# EAGLE design 6502 Based Board (EAGLE 6.6.0)
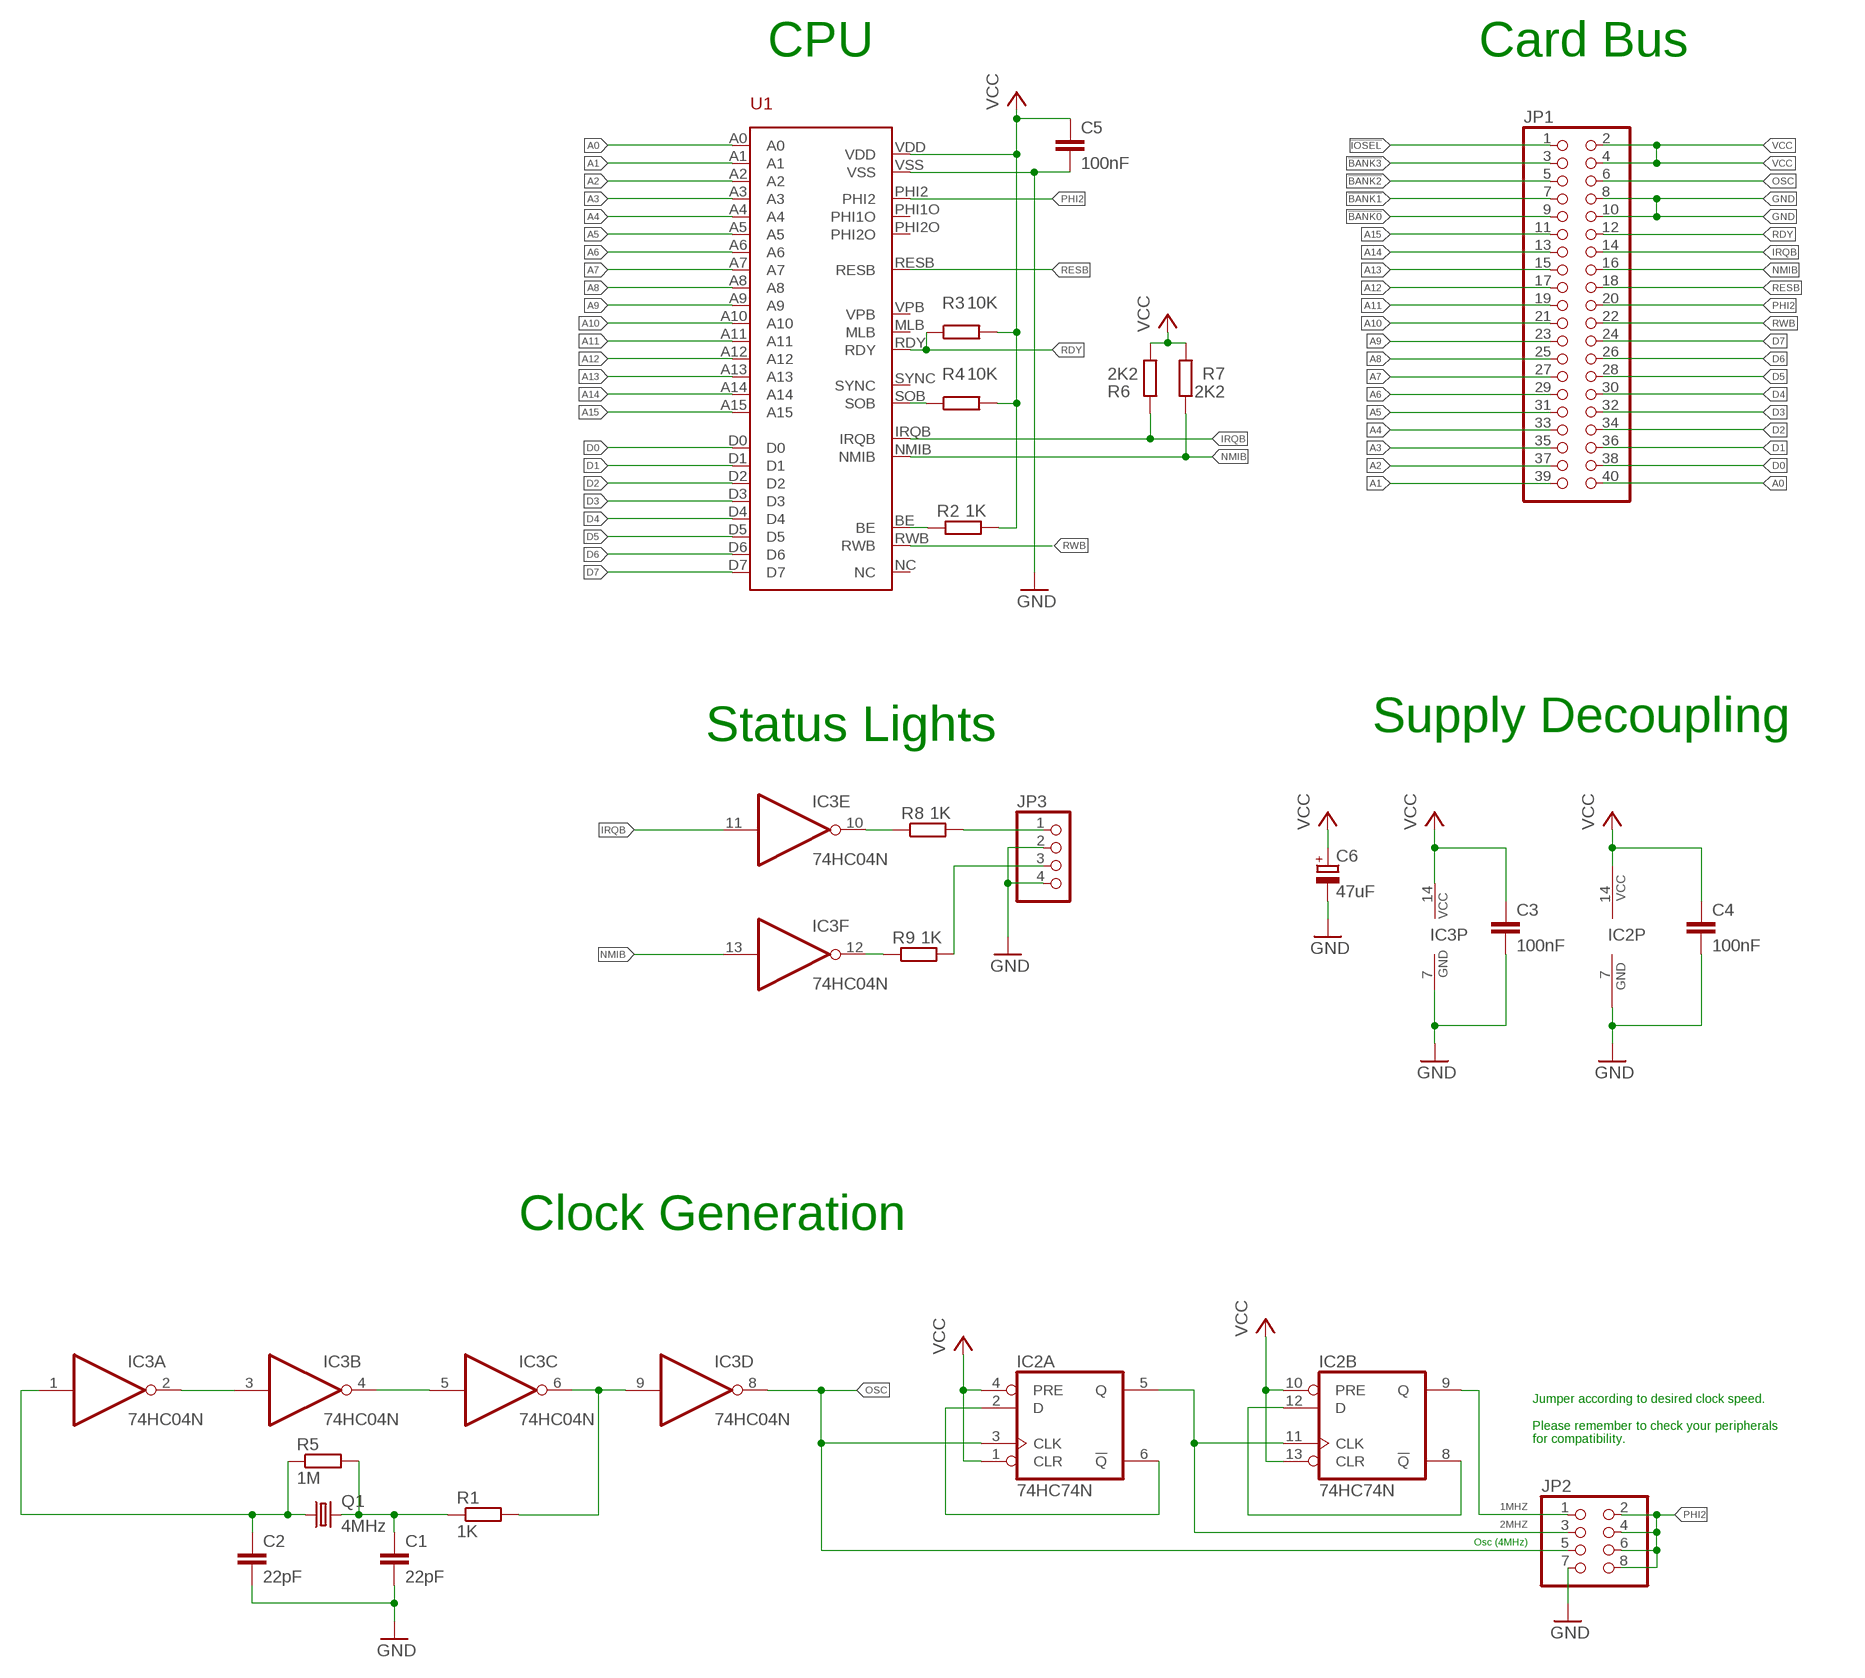
[diagram p0: schematic, sheet 1]

## Parts
C1  22pF  C-EU050-025X075  [C050-025X075]
C2  22pF  C-EU050-025X075  [C050-025X075]
C3  100nF  C-EU050-025X075  [C050-025X075]
C4  100nF  C-EU050-025X075  [C050-025X075]
C5  100nF  C-EU050-025X075  [C050-025X075]
C6  47uF  CPOL-EUE2.5-7  [E2,5-7]
IC2  74HC74N  74LS74N  [DIL14]
IC3  74HC04N  [DIL14]
JP1  PINHD-2X20/90  [2X20/90]
JP2  PINHD-2X4  [2X04]
JP3  PINHD-1X4/90  [1X04/90]
Q1  4MHz  CRYSTALHC49S  [HC49/S]
R1  1K  R-EU_0207/2V  [0207/2V]
R2  1K  R-EU_0207/2V  [0207/2V]
R3  10K  R-EU_0207/2V  [0207/2V]
R4  10K  R-EU_0207/2V  [0207/2V]
R5  1M  R-EU_0207/2V  [0207/2V]
R6  2K2  R-EU_0207/10  [0207/10]
R7  2K2  R-EU_0207/10  [0207/10]
R8  1K  R-EU_0207/2V  [0207/2V]
R9  1K  R-EU_0207/2V  [0207/2V]
U1  W65C02S-DIP  [DIP40]

## Nets
1MHZ: IC2.9(B:Q) JP2.1
2MHZ: IC2.5(A:Q) IC2.11(B:CLK) JP2.3
!BANK0: JP1.9
!BANK1: JP1.7
!BANK2: JP1.5
!BANK3: JP1.3
!IOSEL: JP1.1
A0: JP1.40 U1.A0
A1: JP1.39 U1.A1
A2: JP1.37 U1.A2
A3: JP1.35 U1.A3
A4: JP1.33 U1.A4
A5: JP1.31 U1.A5
A6: JP1.29 U1.A6
A7: JP1.27 U1.A7
A8: JP1.25 U1.A8
A9: JP1.23 U1.A9
A10: JP1.21 U1.A10
A11: JP1.19 U1.A11
A12: JP1.17 U1.A12
A13: JP1.15 U1.A13
A14: JP1.13 U1.A14
A15: JP1.11 U1.A15
D0: JP1.38 U1.D0
D1: JP1.36 U1.D1
D2: JP1.34 U1.D2
D3: JP1.32 U1.D3
D4: JP1.30 U1.D4
D5: JP1.28 U1.D5
D6: JP1.26 U1.D6
D7: JP1.24 U1.D7
GND: C1.2 C2.2 C3.2 C4.2 C5.2 C6.- IC2.7(P:GND) IC3.7(P:GND) JP1.8 JP1.10 JP2.7 JP3.2 JP3.4 U1.VSS
IRQ_LED: JP3.1 R8.2
IRQB: IC3.11(E:I) JP1.14 R6.1 U1.IRQB
N$1: IC2.2(A:D) IC2.6(A:!Q)
N$2: IC3.4(B:O) IC3.5(C:I)
N$3: IC3.6(C:O) IC3.9(D:I) R1.2
N$4: C1.1 Q1.2 R1.1 R5.2
N$5: C2.1 IC3.1(A:I) Q1.1 R5.1
N$7: IC3.2(A:O) IC3.3(B:I)
N$8: IC2.8(B:!Q) IC2.12(B:D)
N$11: IC3.10(E:O) R8.1
N$12: IC3.12(F:O) R9.1
N$15: R2.1 U1.BE
N$16: R4.1 U1.SOB
NMI_LED: JP3.3 R9.2
NMIB: IC3.13(F:I) JP1.16 R7.1 U1.NMIB
OSC: IC2.3(A:CLK) IC3.8(D:O) JP1.6 JP2.5
PHI2: JP1.20 JP2.2 JP2.4 JP2.6 JP2.8 U1.PHI2
RDY: JP1.12 R3.1 U1.RDY
RESB: JP1.18 U1.RESB
RWB: JP1.22 U1.RWB
VCC: C3.1 C4.1 C5.1 C6.+ IC2.1(A:CLR) IC2.4(A:PRE) IC2.10(B:PRE) IC2.13(B:CLR) IC2.14(P:VCC) IC3.14(P:VCC) JP1.2 JP1.4 R2.2 R3.2 R4.2 R6.2 R7.2 U1.VDD
Unconnected: U1.MLB U1.NC U1.PHI1O U1.PHI2O U1.SYNC U1.VPB

## Notes on the sheet
- CPU | Card Bus
- Status Lights | Supply Decoupling
- Clock Generation
- Jumper according to desired clock speed.
  
  Please remember to check your peripherals
  for compatibility.
- Osc (4MHz)

## Library data of the parts
C1-C5 = rcl:C-EU: CAPACITOR, European symbol
C6 = rcl:CPOL-EU: POLARIZED CAPACITOR, European symbol
IC2 = 74xx-us:74*74: Dual D type positive edge triggered FLIP FLOP, preset and clear
IC3 = 74xx-eu:74*04: Hex INVERTER
JP1 = pinhead:PINHD-2X20: PIN HEADER
JP2 = pinhead:PINHD-2X4: PIN HEADER
JP3 = pinhead:PINHD-1X4: PIN HEADER
Q1 = crystal:CRYSTAL: CRYSTAL; OC_FARNELL: 1667008; OC_NEWARK: unknown
R1-R9 = rcl:R-EU_: RESISTOR, European symbol
U1 = W65C02S:W65C02S-DIP

## Board
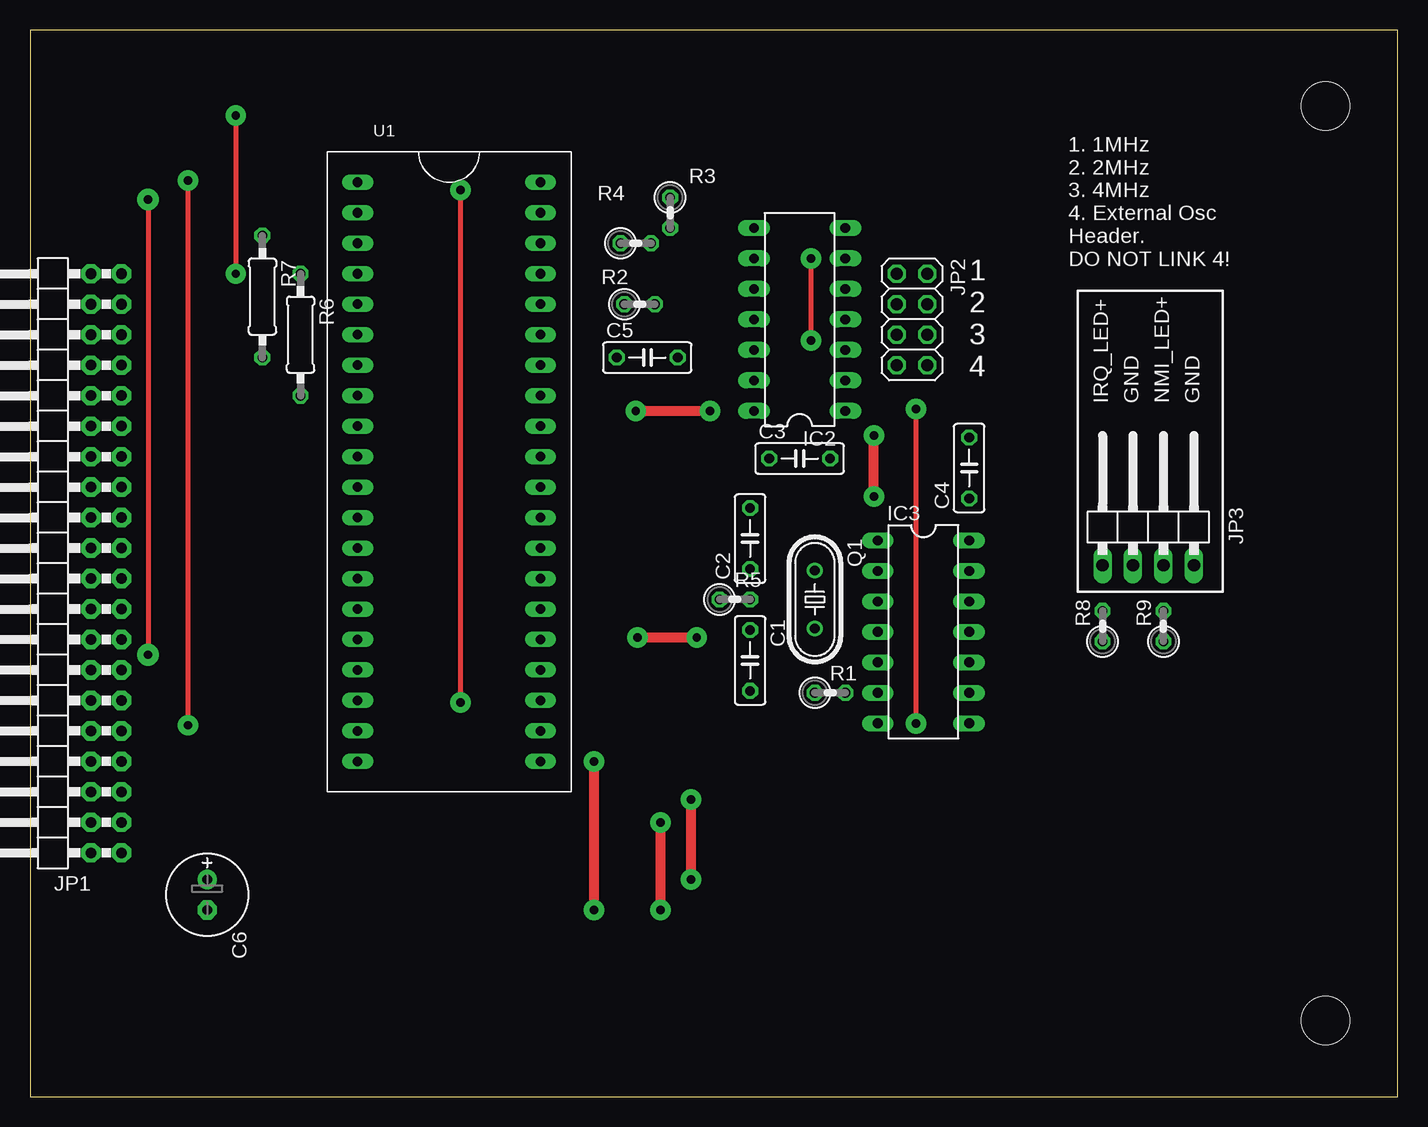
[diagram p1: board, top side]
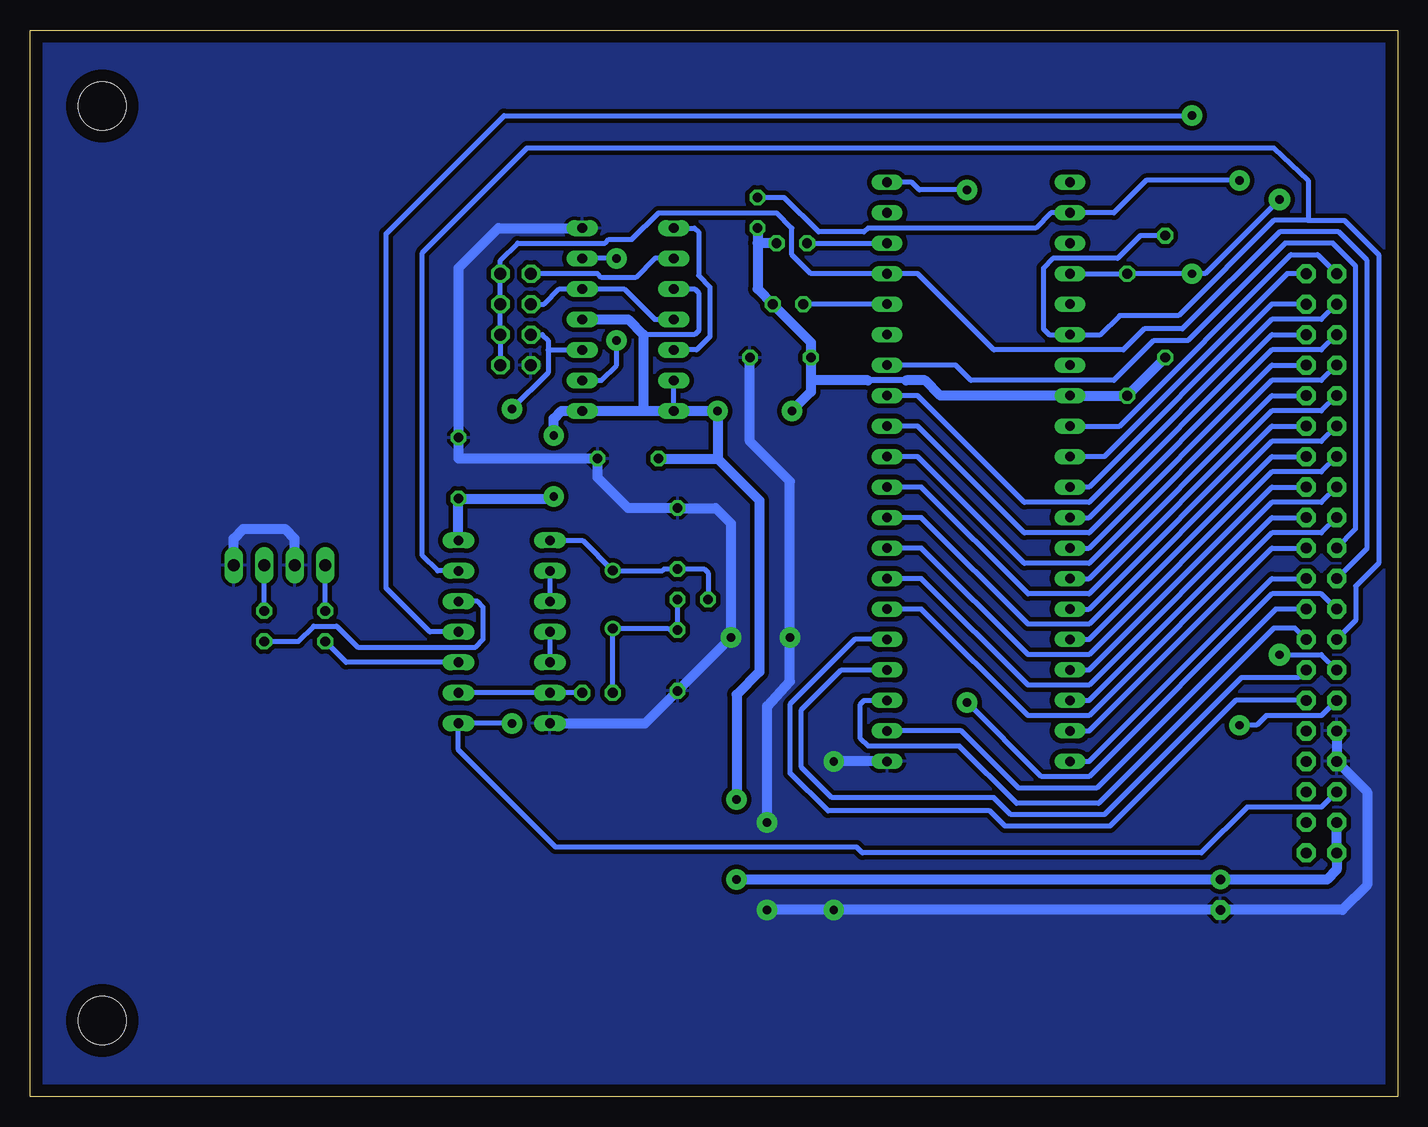
[diagram p2: board, bottom side, seen from below]

Size 113.97 x 88.89 mm. Coordinates in mm from the lower left corner, seen from the top.
Outline: 0,0 113.97,0 113.97,88.89 0,88.89 0,0
Copper layers (1*16): Top 0.035mm / dielectric 1.5mm / Bottom 0.035mm
Design rules "default *": minimum track width 10mil, minimum drill 24mil, track to track 8mil, track to pad 8mil, pad to pad 8mil, via to via 8mil, smd to smd 8mil, copper to edge 40mil, drill to drill 8mil, minimum pad ring 10mil, minimum via ring 8mil, stop-mask expansion 4mil, vias tented up to drill 0mil, thermal gap 12mil
Holes 4 mm at 107.95,82.55 107.95,6.35

### Footprints (pad centres in the part's own frame; a part is rotated, then mirrored left to right if it is on the bottom)
C050-025X075 = drill 0.813 octagon: 1 -2.54,0; 2 2.54,0
E2,5-7 = drill 0.813 pad 1.6: + -1.27,0 | drill 0.813 pad 1.6 octagon: - 1.27,0
DIL14 = drill 0.813 long: 1 -7.62,-3.81; 2 -5.08,-3.81; 3 -2.54,-3.81; 4 0,-3.81; 5 2.54,-3.81; 6 5.08,-3.81; 7 7.62,-3.81; 8 7.62,3.81; 9 5.08,3.81; 10 2.54,3.81; 11 0,3.81; 12 -2.54,3.81; 13 -5.08,3.81; 14 -7.62,3.81
2X20/90 = drill 0.889 pad 1.6 octagon: 1 -24.13,-6.35; 2 -24.13,-3.81; 3 -21.59,-6.35; 4 -21.59,-3.81; 5 -19.05,-6.35; 6 -19.05,-3.81; 7 -16.51,-6.35; 8 -16.51,-3.81; 9 -13.97,-6.35; 10 -13.97,-3.81; 11 -11.43,-6.35; 12 -11.43,-3.81; 13 -8.89,-6.35; 14 -8.89,-3.81; 15 -6.35,-6.35; 16 -6.35,-3.81; 17 -3.81,-6.35; 18 -3.81,-3.81; 19 -1.27,-6.35; 20 -1.27,-3.81; 21 1.27,-6.35; 22 1.27,-3.81; 23 3.81,-6.35; 24 3.81,-3.81; 25 6.35,-6.35; 26 6.35,-3.81; 27 8.89,-6.35; 28 8.89,-3.81; 29 11.43,-6.35; 30 11.43,-3.81; 31 13.97,-6.35; 32 13.97,-3.81; 33 16.51,-6.35; 34 16.51,-3.81; 35 19.05,-6.35; 36 19.05,-3.81; 37 21.59,-6.35; 38 21.59,-3.81; 39 24.13,-6.35; 40 24.13,-3.81
2X04 = drill 1.016 octagon: 1 -3.81,-1.27; 2 -3.81,1.27; 3 -1.27,-1.27; 4 -1.27,1.27; 5 1.27,-1.27; 6 1.27,1.27; 7 3.81,-1.27; 8 3.81,1.27
1X04/90 = drill 1.016 long: 1 -3.81,-3.81; 2 -1.27,-3.81; 3 1.27,-3.81; 4 3.81,-3.81
HC49/S = drill 0.813: 1 -2.413,0; 2 2.413,0
0207/2V = drill 0.813 octagon: 1 -1.27,0; 2 1.27,0
0207/10 = drill 0.813 octagon: 1 -5.08,0; 2 5.08,0
DIP40 = drill 0.8 long: A0 -7.62,3.81; A1 -7.62,1.27; A2 -7.62,-1.27; A3 -7.62,-3.81; A4 -7.62,-6.35; A5 -7.62,-8.89; A6 -7.62,-11.43; A7 -7.62,-13.97; A8 -7.62,-16.51; A9 -7.62,-19.05; A10 -7.62,-21.59; A11 -7.62,-24.13; A12 7.62,-21.59; A13 7.62,-19.05; A14 7.62,-16.51; A15 7.62,-13.97; BE 7.62,13.97; D0 7.62,6.35; D1 7.62,3.81; D2 7.62,1.27; D3 7.62,-1.27; D4 7.62,-3.81; D5 7.62,-6.35; D6 7.62,-8.89; D7 7.62,-11.43; IRQB -7.62,16.51; MLB -7.62,13.97; NC 7.62,11.43; NMIB -7.62,11.43; PHI1O -7.62,19.05; PHI2 7.62,16.51; PHI2O 7.62,21.59; RDY -7.62,21.59; RESB 7.62,24.13; RWB 7.62,8.89; SOB 7.62,19.05; SYNC -7.62,8.89; VDD -7.62,6.35; VPB -7.62,24.13; VSS 7.62,-24.13

### Placement (x,y rotation side)
C1  60.01,36.35 270 top
C2  60.01,46.51 90 top
C3  64.14,53.18 0 top
C4  78.26,52.39 90 top
C5  51.44,61.59 0 top
C6  14.76,16.83 270 top
IC2  64.14,64.77 90 top
IC3  74.45,38.73 270 top
JP1  1.27,44.45 90 top
JP2  73.5,64.77 270 top
JP3  93.19,48.1 0 top
Q1  65.41,41.43 270 top
R1  66.67,33.66 0 top
R2  50.8,66.04 0 top
R3  53.34,73.66 270 top
R4  50.48,71.12 0 top
R5  58.74,41.43 0 top
R6  22.54,63.5 270 top
R7  19.37,66.67 270 top
R8  89.38,39.21 90 top
R9  94.46,39.21 90 top
U1  34.92,52.07 0 top

### Tracks (layer width: path | path; a pad name or v marks a point on that pad's centre or on a via)
1MHZ
  Bottom 0.406: IC2.9 61.91,69.85 63.5,68.26 66.36,68.26 66.67,68.58 JP2.1
2MHZ
  Bottom 0.406: JP2.3 71.12,66.04 69.85,67.31 IC2.5 64.45,67.31 61.91,64.77 IC2.11
A0
  Bottom 0.406: U1.A0 23.18,55.88 8.89,70.17 6.67,70.17 JP1.40
A1
  Bottom 0.406: JP1.39 9.21,68.58 24.45,53.34 U1.A1
A2
  Bottom 0.406: JP1.37 10.48,66.04 25.72,50.8 U1.A2
A3
  Bottom 0.406: U1.A3 25.72,48.26 10.48,63.5 JP1.35
A4
  Bottom 0.406: U1.A4 25.72,45.72 10.48,60.96 JP1.33
A5
  Bottom 0.406: U1.A5 25.72,43.18 10.48,58.42 JP1.31
A6
  Bottom 0.406: U1.A6 25.72,40.64 10.48,55.88 JP1.29
A7
  Bottom 0.406: U1.A7 25.72,38.1 10.48,53.34 JP1.27
A8
  Bottom 0.406: U1.A8 25.72,35.56 10.48,50.8 JP1.25
A9
  Bottom 0.406: U1.A9 25.72,33.02 10.48,48.26 JP1.23
A10
  Bottom 0.406: U1.A10 25.72,30.48 10.48,45.72 JP1.21
A11
  Bottom 0.406: U1.A11 25.72,27.94 10.48,43.18 JP1.19
A12
  Bottom 0.406: JP1.17 10.16,40.64 25.08,25.72 31.59,25.72 36.35,30.48 U1.A12
A13
  Bottom 0.406: JP1.15 8.57,39.05 10.32,39.05 24.92,24.45 31.75,24.45 36.51,29.21 44.13,29.21 44.77,29.84 44.77,32.7 44.45,33.02 U1.A13
A14
  Bottom 0.406: JP1.13 8.26,34.92 13.02,34.92 24.45,23.5 32.23,23.5 33.66,24.92 47.15,24.92 49.69,27.46 49.69,32.23 46.35,35.56 U1.A14
A15
  Bottom 0.406: JP1.11 13.49,33.02 23.97,22.54 32.7,22.54 33.97,23.81 47.47,23.81 50.64,26.99 50.64,32.7 45.24,38.1 U1.A15
D0
  Bottom 0.406: JP1.38 6.35,64.77 10.48,64.77 25.72,49.53 31.11,49.53 40.01,58.42 U1.D0
D1
  Bottom 0.406: JP1.36 6.35,62.23 10.48,62.23 25.72,46.99 31.11,46.99 40.01,55.88 U1.D1
D2
  Bottom 0.406: JP1.34 6.35,59.69 10.48,59.69 25.72,44.45 31.11,44.45 40.01,53.34 U1.D2
D3
  Bottom 0.406: JP1.32 6.35,57.15 10.48,57.15 25.72,41.91 30.8,41.91 39.69,50.8 U1.D3
D4
  Bottom 0.406: JP1.30 6.35,54.61 10.48,54.61 25.72,39.37 30.8,39.37 39.69,48.26 U1.D4
D5
  Bottom 0.406: JP1.28 6.35,52.07 10.48,52.07 25.72,36.83 30.8,36.83 39.69,45.72 U1.D5
D6
  Bottom 0.406: JP1.26 6.35,49.53 10.48,49.53 25.72,34.29 30.8,34.29 39.69,43.18 U1.D6
D7
  Bottom 0.406: JP1.24 6.35,46.99 10.48,46.99 25.72,31.75 30.8,31.75 39.69,40.64 U1.D7
GND  (via drill 0.7 pad 1.7)
  Top 0.813: v52.55,15.56 v52.55,22.86 | v46.99,27.94 v46.99,15.56 | v55.56,38.26 v50.64,38.26
  Bottom 0.813: v52.55,22.86 52.55,32.54 50.64,34.61 v50.64,38.26 50.64,51.28 53.98,54.61 C5.2 | IC2.7 74.93,72.39 78.26,69.06 78.26,53.18 C3.2 66.67,51.59 64.14,49.05 C2.2 56.83,49.05 55.56,47.78 v55.56,38.26 C1.2 62.71,31.11 IC3.7 | U1.VSS v46.99,27.94 | JP1.10 JP1.8 2.54,25.4 2.54,17.62 4.6,15.56 C6.- v46.99,15.56 v52.55,15.56 | JP3.4 97,46.51 96.2,47.31 92.71,47.31 91.92,46.51 JP3.2
  pour Bottom (isolate 0.381): 0,88.9 0,0 114.14,0 114.14,88.9
IRQ_LED
  Bottom 0.406: R8.2 JP3.1
IRQB  (via drill 0.7 pad 1.7, 0.7 pad 1.8)
  Top 0.406: v9.84,74.77 v9.84,36.83 | v17.14,81.76 v17.14,68.58
  Bottom 0.406: U1.IRQB R6.1 v17.14,68.58 16.03,68.58 v9.84,74.77 | v9.84,36.83 6.35,36.83 JP1.14 | v17.14,81.76 74.45,81.76 84.3,71.91 84.3,42.39 80.64,38.73 IC3.11
N$1  (via drill 0.7 pad 1.7)
  Top 0.406: v65.09,63.02 v65.09,69.85
  Bottom 0.406: IC2.2 66.36,59.69 65.09,60.96 v65.09,63.02 | v65.09,69.85 IC2.6
N$2
  Bottom 0.406: IC3.4 IC3.5
N$3
  Bottom 0.406: IC3.9 IC3.6 R1.2
N$4
  Bottom 0.406: R1.1 Q1.2 60.83,39.02 60.64,38.89 C1.1 R5.2
N$5
  Bottom 0.406: R5.1 57.47,43.66 57.78,43.97 C2.1 61.12,43.97 61.25,43.85 Q1.1 67.91,46.35 IC3.1
N$7
  Bottom 0.406: IC3.2 IC3.3
N$8
  Bottom 0.406: IC2.8 58.58,72.39 58.26,72.07 58.26,68.42 57.31,67.47 57.31,63.34 58.42,62.23 IC2.12
N$11
  Bottom 0.406: IC3.10 87.63,36.2 R8.1
N$12
  Bottom 0.406: R9.1 91.6,37.94 90.33,39.21 88.42,39.21 86.68,37.47 76.83,37.47 76.2,38.1 76.2,40.8 76.68,41.27 IC3.12
N$15
  Bottom 0.406: U1.BE R2.1
N$16
  Bottom 0.406: R4.1 U1.SOB
NMI_LED
  Bottom 0.406: R9.2 JP3.3
NMIB
  Bottom 0.406: 7.46,73.03 4.45,73.03 1.59,70.17 1.59,44.45 3.49,42.55 3.49,39.69 JP1.16 | 7.46,73.03 7.46,76.36 10.32,79.06 72.55,79.06 81.28,70.33 81.28,45.09 80.01,43.81 IC3.13 | 7.46,73.03 10.32,73.03 18.26,65.09 23.18,65.09 24.77,63.5 U1.NMIB 29.05,63.5 29.53,63.98 29.53,69.06 28.73,69.85 23.34,69.85 21.43,71.75 R7.1
OSC  (via drill 0.7 pad 1.7)
  Top 0.406: v73.82,57.31 v73.82,31.11
  Bottom 0.406: 70.8,62.23 IC2.3 | JP2.5 71.28,63.5 70.8,63.02 70.8,62.23 | v73.82,31.11 IC3.8 78.26,28.89 70.17,20.8 45.09,20.8 44.61,20.32 16.35,20.32 12.54,24.13 6.35,24.13 JP1.6 | v73.82,57.31 70.8,60.33 70.8,62.23
PHI2
  Bottom 0.406: JP1.20 2.54,45.72 2.54,69.69 4.92,72.07 9.84,72.07 17.94,63.98 21.11,63.98 22.86,62.23 33.66,62.23 40.01,68.58 U1.PHI2 48.9,68.58 50.48,70.17 50.48,72.39 51.75,73.66 61.59,73.66 63.82,71.44 65.72,71.44 66.04,71.12 73.34,71.12 74.77,69.69 JP2.2 JP2.4 JP2.6 JP2.8
RDY  (via drill 0.7 pad 1.7)
  Top 0.406: v13.18,30.96 v13.18,76.36
  Bottom 0.406: R3.1 51.12,74.93 48.26,72.07 44.45,72.07 44.13,72.39 30.16,72.39 28.89,73.66 U1.RDY 23.65,73.66 20.95,76.36 v13.18,76.36 | JP1.12 6.35,31.75 10.95,31.75 11.75,30.96 v13.18,30.96
RESB  (via drill 0.7 pad 1.7)
  Top 0.406: v35.88,32.86 v35.88,75.56
  Bottom 0.406: JP1.18 6.35,41.91 10.48,41.91 25.72,26.67 29.69,26.67 v35.88,32.86 | v35.88,75.56 39.85,75.56 40.48,76.2 U1.RESB
RWB
  Bottom 0.406: JP1.22 3.49,47.31 3.49,69.22 5.4,71.12 9.37,71.12 17.46,63.02 20.32,63.02 23.65,59.69 35.56,59.69 36.83,60.96 U1.RWB
VCC  (via drill 0.7 pad 1.7)
  Top 0.813: v50.48,57.15 v56.67,57.15 | v55.09,18.1 v55.09,24.77 | v70.33,50.01 v70.33,55.09
  Bottom 0.406: IC2.10 58.58,67.31 58.26,66.99 58.26,63.82 58.58,63.5 62.87,63.5 | IC2.14 IC2.13
  Bottom 0.508: 40.96,59.69 44.13,59.69
  Bottom 0.813: 56.67,53.18 v56.67,57.15 IC2.14 62.87,57.15 | 56.67,53.18 53.18,49.69 53.18,35.4 55.09,33.5 v55.09,24.77 | C3.1 56.67,53.18 | 40.96,59.69 39.37,59.69 38.1,58.42 U1.VDD R6.2 R7.2 | 44.13,59.69 48.9,59.69 | v50.48,57.15 48.9,58.74 48.9,59.69 | 48.9,59.69 C5.1 48.9,62.87 R2.2 53.34,67.31 53.34,71.12 | v55.09,18.1 C6.+ 5.87,18.1 5.08,18.89 JP1.2 JP1.4 | 62.87,57.15 IC2.1 69.69,57.15 70.33,56.52 v70.33,55.09 | IC2.4 64.14,64.77 62.87,63.5 62.87,57.15 | R3.2 53.34,71.12 | R4.2 53.34,71.12 | IC3.14 C4.1 70.17,49.85 v70.33,50.01

### Text on the board
tNames: 1. 1MHz / 2. 2MHz / 3. 4MHz / 4. External Osc / Header. / DO NOT LINK 4! | 1 / 2 / 3 / 4 | IRQ_LED+ | GND | NMI_LED+ | GND